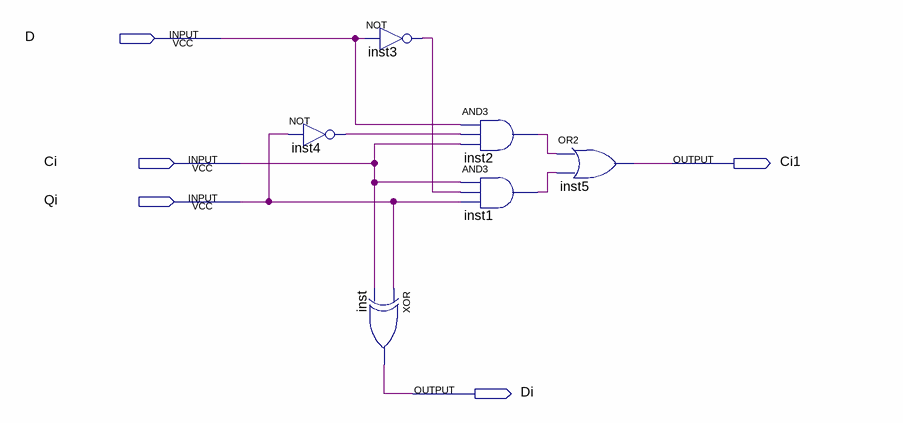
[diagram p0: schematic sheet]
// Quartus schematic HAS.bdf as structural Verilog: 6 symbols, 5 pins
module HAS (
  input  D,
  input  Ci,
  input  Qi,
  output Ci1,
  output Di
);

  wire inst1_out, inst2_out, inst3_out, inst4_out;

  not inst4 (inst4_out, Qi);
  not inst3 (inst3_out, D);
  xor inst (Di, Qi, Ci);
  and inst2 (inst2_out, D, inst4_out, Ci);
  and inst1 (inst1_out, Ci, inst3_out, Qi);
  or inst5 (Ci1, inst2_out, inst1_out);
endmodule
